# EasyEDA schematic SCH_Andrew's-NFC-Card_2024-04-20.json
TITLE: Sheet_1; REV: 1.0; Date: 2024-04-18; Sheet: 1/1; Drawn By: radi8; Company: Your Company
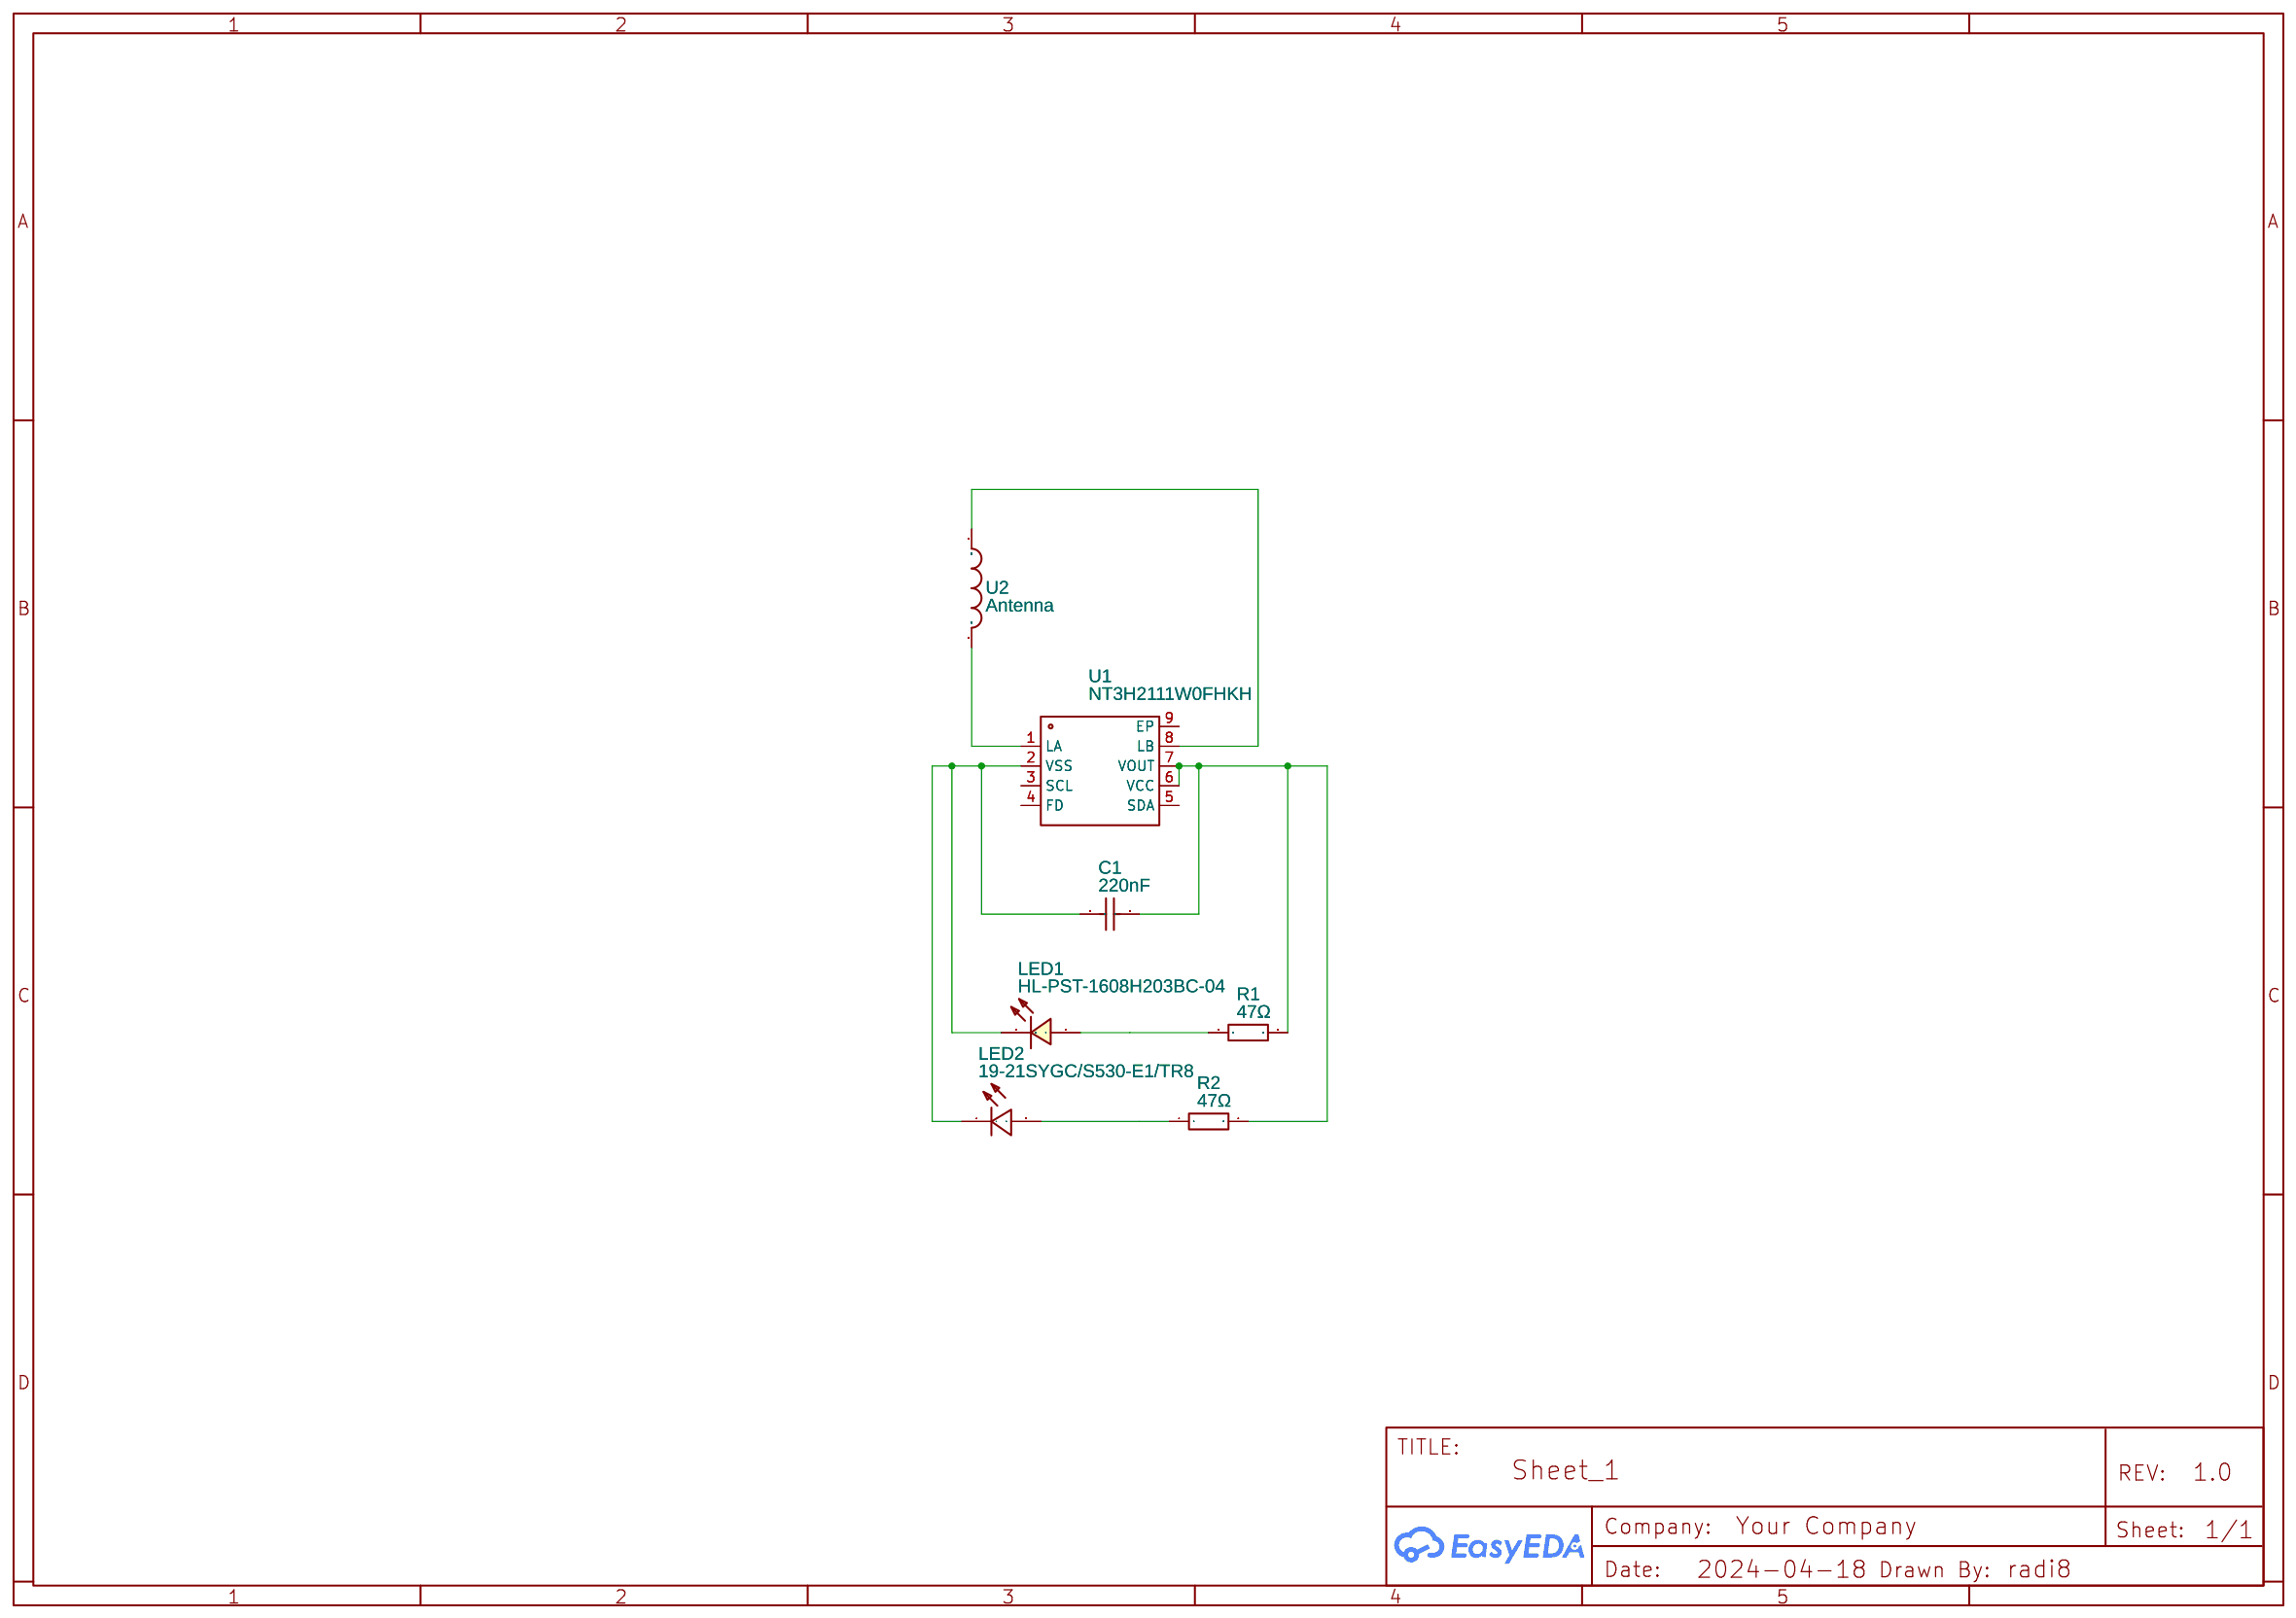
[diagram p0: schematic sheet]

## Parts
C1  220nF  [C0603]
LED1  HL-PST-1608H203BC-04  [LED0603-RD_BLUE]
LED2  19-21SYGC/S530-E1/TR8  [LED0603-RD_GREEN]
R1  47Ω  [R0603]
R2  47Ω  [R0603]
U1  NT3H2111W0FHKH  [XQFN-8_L1.6-W1.6-P0.50-BL]
U2  Antenna  [25X48MM_NFC_ANTENNA]

## Library data of the parts
C1 = CL10B224KA8NNNC: Supplier: LCSC; Manufacturer: SAMSUNG(三星); Supplier Part: C21120; JLCPCB Part Class: Basic Part
LED1 = HL-PST-1608H203BC-04: Contributor: LCSC; Supplier: LCSC; Supplier Part: C497939; Manufacturer: HONGLITRONIC(鸿利光电); JLCPCB Part Class: Extended Part
LED2 = 19-21SYGC/S530-E1/TR8: Contributor: LCSC; Supplier: LCSC; Supplier Part: C9900009799; Manufacturer: null; JLCPCB Part Class: Extended Part
R1 R2 = 0603WAF470JT5E: Supplier: LCSC; Manufacturer: UNI-ROYAL(厚声); Supplier Part: C23182; JLCPCB Part Class: Basic Part
U1 = NT3H2111W0FHKH: Contributor: LCSC; Supplier: LCSC; Supplier Part: C710403; Manufacturer: NXP(恩智浦); JLCPCB Part Class: Extended Part
U2 = Antenna: Contributor: maggie.j.liu

## Nets
Net-(C1-1): C1.1 LED1.1(C) LED2.1(-) U1.2(VSS)
Net-(C1-2): C1.2 R1.2 R2.2 U1.6(VCC) U1.7(VOUT)
Net-(LED1-2): LED1.2(A) R1.1
Net-(LED2-2): LED2.2(+) R2.1
Net-(U1-1): U1.1(LA) U2.P$1
Net-(U1-8): U1.8(LB) U2.P$2

Not connected (* = marked no-connect by the designer): U1 3(SCL) 4(FD) 5(SDA) 9(EP)
